# Altium schematic sheet Modular_BO.SchDoc
size C; SheetNumber: 3; SheetTotal: 4
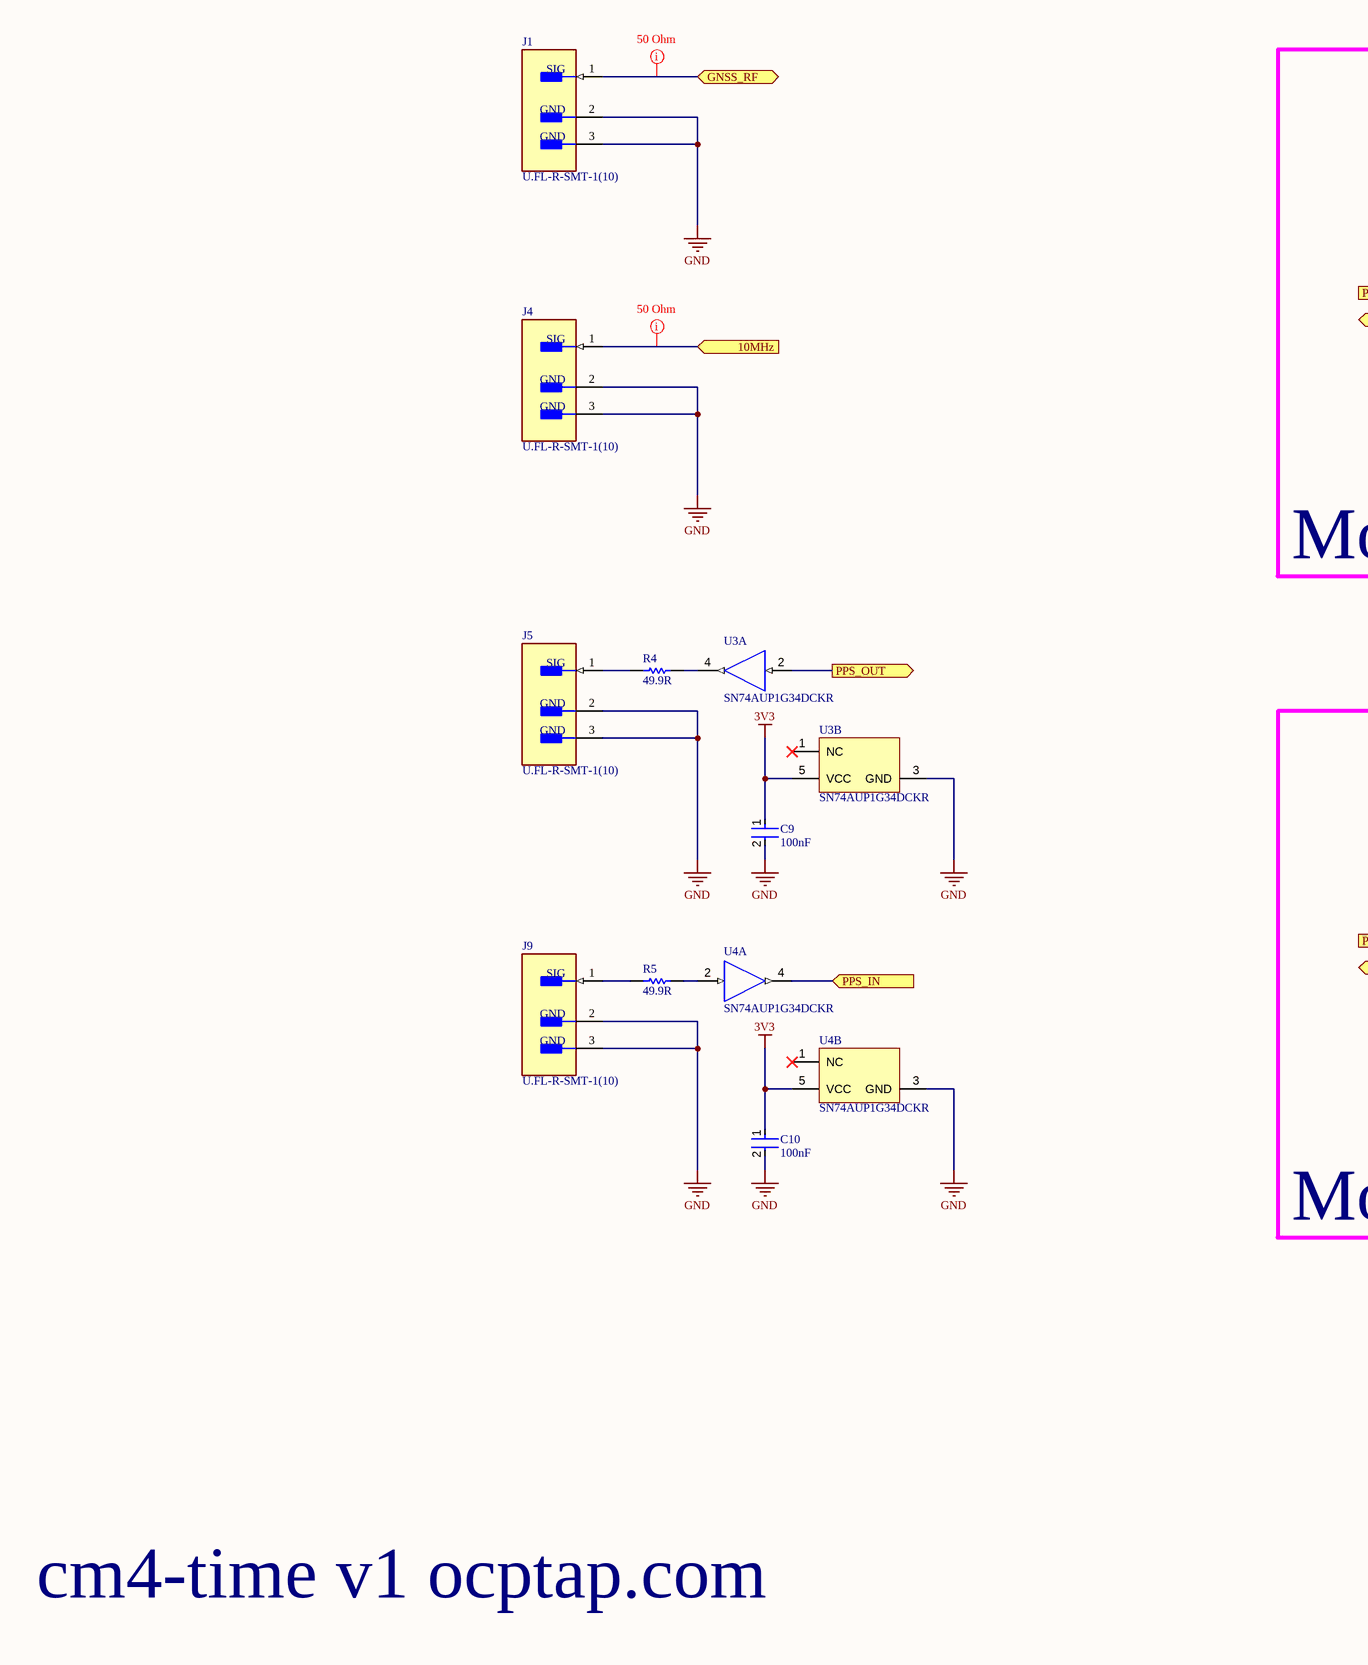
[diagram p0: Modular_BO.SchDoc, left]
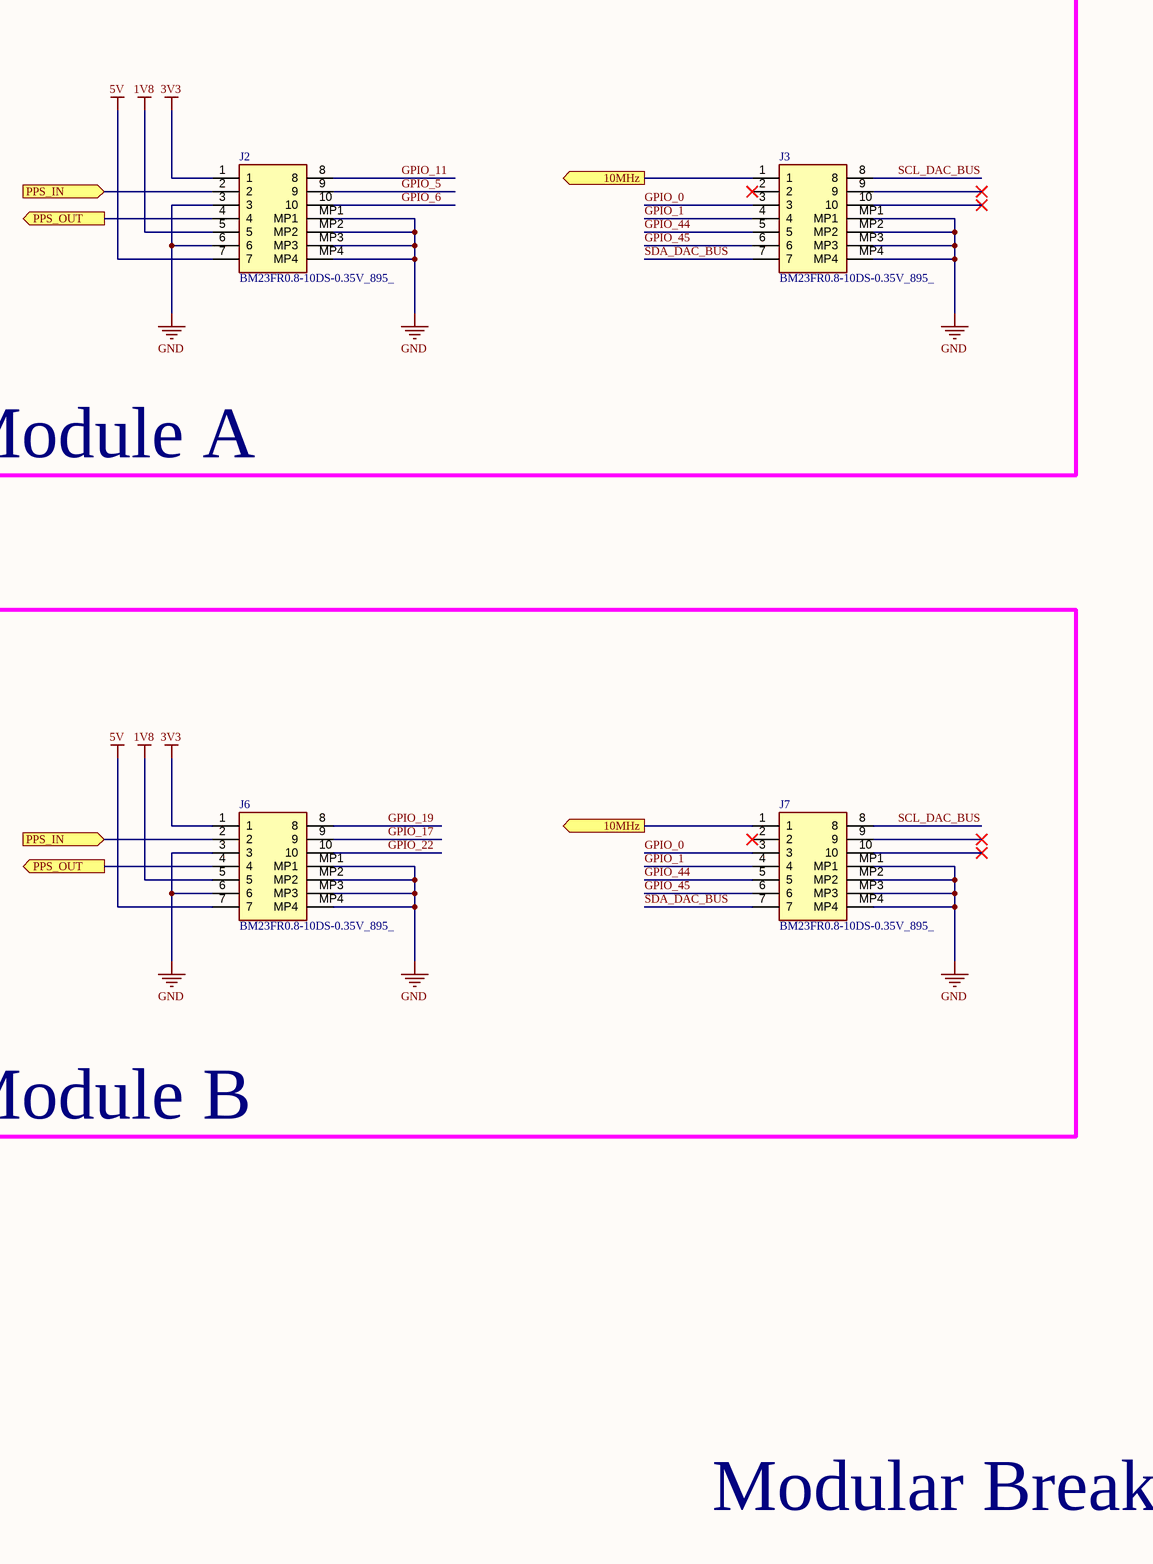
[diagram p1: Modular_BO.SchDoc, right]

## Parts
C9  100nF  [FP-C0603C-CF-MFG]
C10  100nF  [FP-C0603C-CF-MFG]
J1  U.FL-R-SMT-1(10)  [FP-U_FL-R-SMT-1_10-MFG]
J2  BM23FR0.8-10DS-0.35V_895_  [BM23FR0810DS035V895]
J3  BM23FR0.8-10DS-0.35V_895_  [BM23FR0810DS035V895]
J4  U.FL-R-SMT-1(10)  [FP-U_FL-R-SMT-1_10-MFG]
J5  U.FL-R-SMT-1(10)  [FP-U_FL-R-SMT-1_10-MFG]
J6  BM23FR0.8-10DS-0.35V_895_  [BM23FR0810DS035V895]
J7  BM23FR0.8-10DS-0.35V_895_  [BM23FR0810DS035V895]
J9  U.FL-R-SMT-1(10)  [FP-U_FL-R-SMT-1_10-MFG]
R4  49.9R  [RESC1608X55X25NL10T15]
R5  49.9R  [RESC1608X55X25NL10T15]
U3  SN74AUP1G34DCKR  [DCK0005A_M]  (parts A,B of 2)
U4  SN74AUP1G34DCKR  [DCK0005A_M]  (parts A,B of 2)

## Blocks framed on the sheet
Module A: J2 J3
Module B: J6 J7

## Ports
10MHz (in), 10MHz (out), GNSS_RF (bidir), PPS_IN (in), PPS_OUT (out)

## Nets
1V8: J2.5 J6.5
3V3: C9.1 C10.1 J2.1 J6.1 U3.5(VCC) U4.5(VCC)
5V: J2.7 J6.7
GND: C9.2 C10.2 J1.2(GND) J1.3(GND) J2.3 J2.6 J2.MP1 J2.MP2 J2.MP3 J2.MP4 J3.MP1 J3.MP2 J3.MP3 J3.MP4 J4.2(GND) J4.3(GND) J5.2(GND) J5.3(GND) J6.3 J6.6 J6.MP1 J6.MP2 J6.MP3 J6.MP4 J7.MP1 J7.MP2 J7.MP3 J7.MP4 J9.2(GND) J9.3(GND) U3.3(GND) U4.3(GND)
10MHz: J3.1 J4.1(SIG) J7.1 ; port 10MHz
GNSS_RF: J1.1(SIG) ; port GNSS_RF
GPIO_0: J3.3 J7.3
GPIO_1: J3.4 J7.4
GPIO_5: J2.9
GPIO_6: J2.10
GPIO_11: J2.8
GPIO_17: J6.9
GPIO_19: J6.8
GPIO_22: J6.10
GPIO_44: J3.5 J7.5
GPIO_45: J3.6 J7.6
PPS_IN: J2.2 J6.2 U4.4(Y) ; port PPS_IN
PPS_OUT: J2.4 J6.4 U3.2(A) ; port PPS_OUT
SCL_DAC_BUS: J3.8 J7.8
SDA_DAC_BUS: J3.7 J7.7
NetJ5_1: J5.1(SIG) R4.1
NetJ9_1: J9.1(SIG) R5.1
NetR4_2: R4.2 U3.4(Y)
NetR5_2: R5.2 U4.2(A)

Not connected (* = marked no-connect by the designer): J3 2* 9* 10*; J7 2* 9* 10*; U3 1(NC)*; U4 1(NC)*

## Layout directives
net class RF: 10MHz, GNSS_RF

## Notes on the sheet
- cm4-time v1 ocptap.com
- Modular Breakouts
- DWG. NO.
- REV.
- SHT.
- REVISION
- DESCRIPTION
- DATE
- APPROVED
- THIS DOCUMENT AND THE DATA DISCLOSED HEREIN OR HEREWITH IS THE PROPERTY OF ALTIUM LIMITED AND MAY BE FREELY DISTRIBUTED IN WHOLE. NO RIGHTS ARE RESERVED OR EXPRESS OR IMPLIED WARANTEE GIVEN.
- ENG:
- DSN:
- APPROVALS
- PROJECT
- DOCUMENT REVISION:
- DESIGN ITEM:
- CHK:
- BOM:
- REFERENCE DOCUMENTS
- PROJECT REVISION:
- TITLE
- FAB DWG:
- PCB DWG:
- ASSY DWG:
- SCALE:
- SIZE
- C
- CAGE CODE
- FILE NAME
- DWG NO.
- SHEET
- OF
- REV

## Library data of the parts
C9 C10 = CMP-2006-03068-2: CAP CER 0.1UF 50V 20% X7R 0603; Manufacturer Part Number: C0603C104M5RACTU; Manufacturer: KEMET; Material: Ceramic; Tolerance: 0.2; Value: 0.10 μF; Temperature Coefficient: 30ppm/°C; Automotive Grade: Grade 1; Temperature Range High: +125°C; Voltage Rating: 50 V; Device Class L3: Ceramic Capacitors; Height: 0.87mm; Category: Cap; RoHS: TRUE; Digikey Description: CAP CER 0.1UF 50V 20% X7R 0603; ComponentLink2URL: https://api.kemet.com/component-edge/download/datasheet/C0603C100J5GACAUTO.pdf; Lead Free: Yes; Temperature Range Low: -55°C; Device Class L1: Passive Components; ComponentLink2Description: Datasheet; Temperature Characteristic: X7R; Automotive: Yes; Temperature: -55°C to +125°C; Octopart: https://octopart.com/c0603c104m5ractu-kemet-11855687; Device Class L2: Capacitors; Package: C0603C-CF; Mouser Description: Multilayer Ceramic Capacitors MLCC - SMD/SMT 50volts 0.1uF X7R 20%; Capacitance: 0.10 μF
J1 J4 J5 J9 = CMP-2000-05152-3: CONN U.FL RCPT STR 50 OHM SMD; Max Frequency: 6GHz; Connector Type: Coaxial; Body Plating: Silver; Body Material: Bronze; Impedance: 50R; Dielectric Material: Polymer; Insulation Resistance: 500MR; Gender: Male; Packaging: Cut Tape; Length: 3mm; Package Quantity: 2500; Termination: Solder; Lead Free: Lead Free; Series: U.FL; Min Operating Temperature: -40°C; Fastening Type: Snap; Contact Material: Brass; Orientation: Straight; Wire/Cable Type: Coaxial; Frequency: 6GHz; Contact Plating: Gold; Depth: 3.1mm; Weight: 0.001764oz; Max Operating Temperature: 90°C; Radiation Hardening: No; REACH SVHC: No SVHC; Mount: Surface Mount; Housing Color: Beige
J2 J3 J6 J7 = BM23FR0.8-10DS-0.35V_895_: Connector; Manufacturer_Name: Hirose; Manufacturer_Part_Number: BM23FR0.8-10DS-0.35V(895); Datasheet Link: https://componentsearchengine.com/Datasheets/1/BM23FR0.8-10DS-0.35V(895).pdf; Height: 0.9mm; Mouser Part Number: 798-3FR0810DS035V895; Mouser Price/Stock: https://www.mouser.co.uk/ProductDetail/Hirose-Connector/BM23FR08-10DS-035V895/?qs=YCa%2FAAYMW01IXWgIGURT8A%3D%3D
R4 R5 = CMP-1659-00036-1: General Purpose Chip Resistor, 49.9 Ohm, +/- 1%, -55 to 155 degC, 0603 (1608 Metric), RoHS, Tape and Reel; Max Supply Voltage: 3.63 V; Case\Package: LQFP; Interface: SPI; Min Supply Voltage: 2.97 V; PackageReference: 0603; Packaging: Tray; ComponentLink2Description: Datasheet; ComponentLink1Description: Manufacturer URL; ComponentLink2URL: https://datasheet.ciiva.com/11808/0900766b80f96399-11808223.pdf; RoHSCompliant: true; Max Operating Temperature: 85 degC; ComponentLink1URL: http://www.yageo.com/; PackageDescription: 2-Pin Surface Mount Device, Body 1.6 x 0.8 mm; DatasheetVersion: Rev. 4, 04/2009; Min Operating Temperature: -40 degC; Package Quantity: 250; Pins: 48
U3 U4 = CMP-0859-00353-3: Low-Power Single Buffer Gate, DCK0005A, LARGE T&R; Manufacturer: Texas Instruments; ICC @ Nom Voltage(Max)(mA): 0.0009; Bits(#): 1; F @ Nom Voltage(Max)(Mhz): 100; Input Type: CMOS; Logic: True; VCC(Min)(V): 0.8; Rating: Catalog; Sub-Family: Non-Inverting Buffer/Driver; Voltage(Nom)(V): 0.8,1.2,1.5,1.8,2.5,3.3; tpd @ Nom Voltage(Max)(ns): 36.3,16.3,11,9.3,6.4,5.3; Output Drive (IOL/IOH)(Max)(mA): 20/-20; Technology Family: AUP; Schmitt Trigger: No; VCC(Max)(V): 3.6; DatasheetVersion: SCES603K; PackageReference: DCK0005A; Generic Part Number: SN74AUP1G34; Operating Temperature Range(C): -40 to 85; 3-State Output: No; Output Type: CMOS